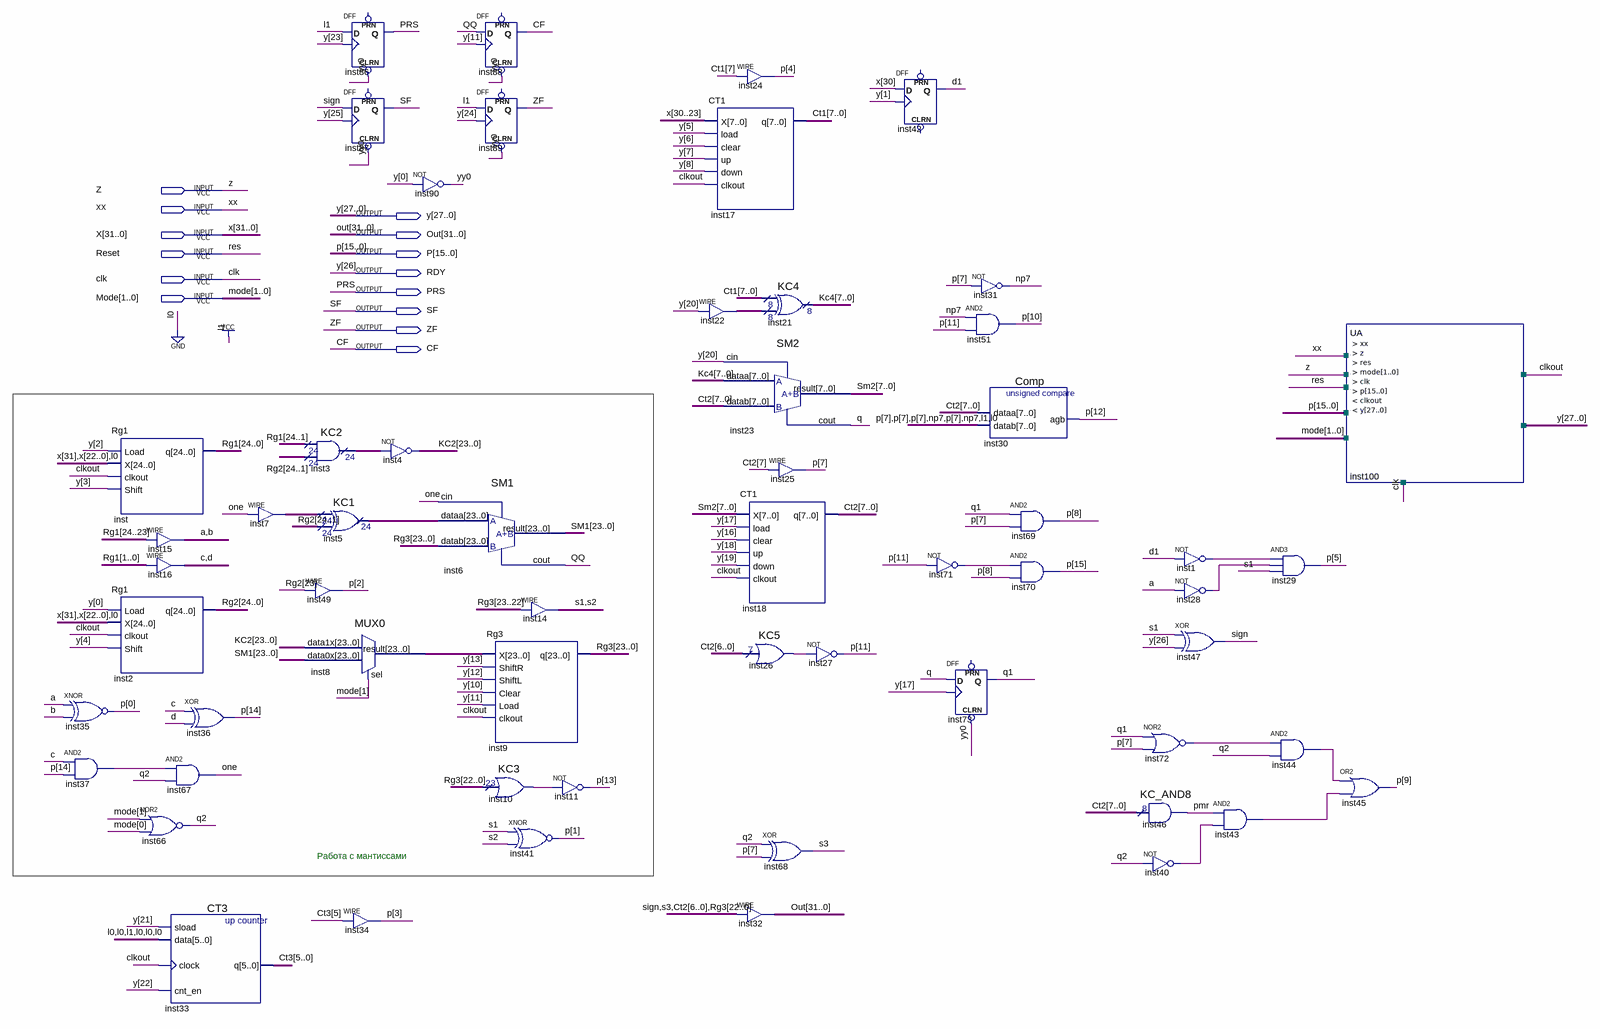
[diagram p0: schematic sheet]
// Quartus schematic lab.bdf as structural Verilog: 58 symbols, 14 pins
module lab (
  input  Z,
  input  XX,
  input  [31:0] X,
  input  Reset,
  input  clk,
  input  [1:0] Mode,
  output [27:0] y,
  output [31:0] Out,
  output [15:0] P,
  output RDY,
  output PRS,
  output SF,
  output ZF,
  output CF
);

  wire a, b, c, clkout, d, d1, inst1_out, inst10_result, inst26_result, inst28_out, inst37_out, inst40_out,
       inst43_out, inst44_out, inst71_out, inst72_out, np7, one, pmr, q, q1, q2, QQ, s1, s2, s3, sign, yy0;
  wire [5:0] Ct3;
  wire [7:0] Ct1, Ct2, inst22_out, Kc4, Sm2;
  wire [23:0] inst3_result, inst5_result, inst7_out, inst8_result, KC2, Rg3, SM1;
  wire [24:0] Rg1, Rg2;

  xnor inst35 (P[0], a, b);
  and inst37 (inst37_out, c, P[14]);
  Rg1 inst (.Load(y[2]), .X({X[31], X[22:0], 1'b0}), .clkout(clkout), .Shift(y[3]), .q(Rg1));
  Rg1 inst2 (.Load(y[0]), .X({X[31], X[22:0], 1'b0}), .clkout(clkout), .Shift(y[4]), .q(Rg2));
  assign {a, b} = Rg1[24:23];  // WIRE inst15
  assign {c, d} = Rg1[1:0];  // WIRE inst16
  xor inst36 (P[14], c, d);
  and inst67 (one, inst37_out, q2);
  nor inst66 (q2, Mode[1], Mode[0]);
  CT3 inst33 (.sload(y[21]), .data(6'b001000), .clock(clkout), .cnt_en(y[22]), .q(Ct3));
  assign inst7_out = {24{one}};  // WIRE inst7
  KC2 inst3 (.data0x(Rg1[24:1]), .data1x(Rg2[24:1]), .result(inst3_result));
  KC1 inst5 (.data0x(inst7_out), .data1x(Rg2[24:1]), .result(inst5_result));
  assign P[2] = Rg2[23];  // WIRE inst49
  MUX0 inst8 (.data1x(KC2), .data0x(SM1), .sel(Mode[1]), .result(inst8_result));
  DFF inst86 (.CLRN(yy0), .CLK(y[23]), .D(1'b1), .Q(PRS));  // open: PRN
  DFF inst87 (.CLRN(yy0), .CLK(y[25]), .D(sign), .Q(SF));  // open: PRN
  assign KC2 = ~inst3_result;  // NOT inst4, 24 bits wide
  assign P[3] = Ct3[5];  // WIRE inst34
  not inst90 (yy0, y[0]);
  SM1 inst6 (.dataa(inst5_result), .datab(Rg3), .cin(one), .result(SM1), .cout(QQ));
  DFF inst88 (.CLRN(yy0), .CLK(y[11]), .D(QQ), .Q(CF));  // open: PRN
  DFF inst89 (.CLRN(yy0), .CLK(y[24]), .D(1'b1), .Q(ZF));  // open: PRN
  Rg3 inst9 (.X(inst8_result), .ShiftR(y[13]), .ShiftL(y[12]), .Clear(y[10]), .Load(y[11]), .clkout(clkout), .q(Rg3));
  KC3 inst10 (.data(Rg3[22:0]), .result(inst10_result));
  assign {s1, s2} = Rg3[23:22];  // WIRE inst14
  xnor inst41 (P[1], s1, s2);
  not inst11 (P[13], inst10_result);
  assign P[4] = Ct1[7];  // WIRE inst24
  CT1 inst17 (.X(X[30:23]), .load(y[5]), .clear(y[6]), .up(y[7]), .down(y[8]), .clkout(clkout), .q(Ct1));
  assign inst22_out = {8{y[20]}};  // WIRE inst22
  SM2 inst23 (.dataa(Kc4), .datab(Ct2), .cin(y[20]), .result(Sm2), .cout(q));
  CT1 inst18 (.X(Sm2), .load(y[17]), .clear(y[16]), .up(y[18]), .down(y[19]), .clkout(clkout), .q(Ct2));
  KC5 inst26 (.data(Ct2[6:0]), .result(inst26_result));
  assign Out = {sign, s3, Ct2[6:0], Rg3[22:0]};  // WIRE inst32
  KC4 inst21 (.data0x(Ct1), .data1x(inst22_out), .result(Kc4));
  assign P[7] = Ct2[7];  // WIRE inst25
  xor inst68 (s3, q2, P[7]);
  not inst27 (P[11], inst26_result);
  DFF inst42 (.CLK(y[1]), .D(X[30]), .Q(d1));  // open: CLRN, PRN
  not inst71 (inst71_out, P[11]);
  DFF inst73 (.CLRN(yy0), .CLK(y[17]), .D(q), .Q(q1));  // open: PRN
  not inst31 (np7, P[7]);
  and inst51 (P[10], np7, P[11]);
  Comp inst30 (.dataa(Ct2), .datab({{3{P[7]}}, np7, P[7], np7, 2'b10}), .agb(P[12]));
  and inst69 (P[8], q1, P[7]);
  and inst70 (P[15], inst71_out, P[8]);
  nor inst72 (inst72_out, q1, P[7]);
  KC_AND8 inst46 (.data(Ct2), .result(pmr));
  not inst40 (inst40_out, q2);
  not inst1 (inst1_out, d1);
  not inst28 (inst28_out, a);
  xor inst47 (sign, s1, RDY);
  and inst43 (inst43_out, pmr, inst40_out);
  and inst29 (P[5], inst1_out, inst28_out, s1);
  and inst44 (inst44_out, inst72_out, q2);
  UA inst100 (.xx(XX), .z(Z), .res(Reset), .mode(Mode), .clk(clk), .p(P), .clkout(clkout), .y({y[27], RDY, y[25:0]}));
  or inst45 (P[9], inst44_out, inst43_out);

  assign y[26] = RDY;

  // Other names for the same wires on the sheet: res = Reset

  // Notes on the sheet:
  //   Работа с мантиссами
endmodule
